# EAGLE design wiegand (EAGLE 6.6.0)
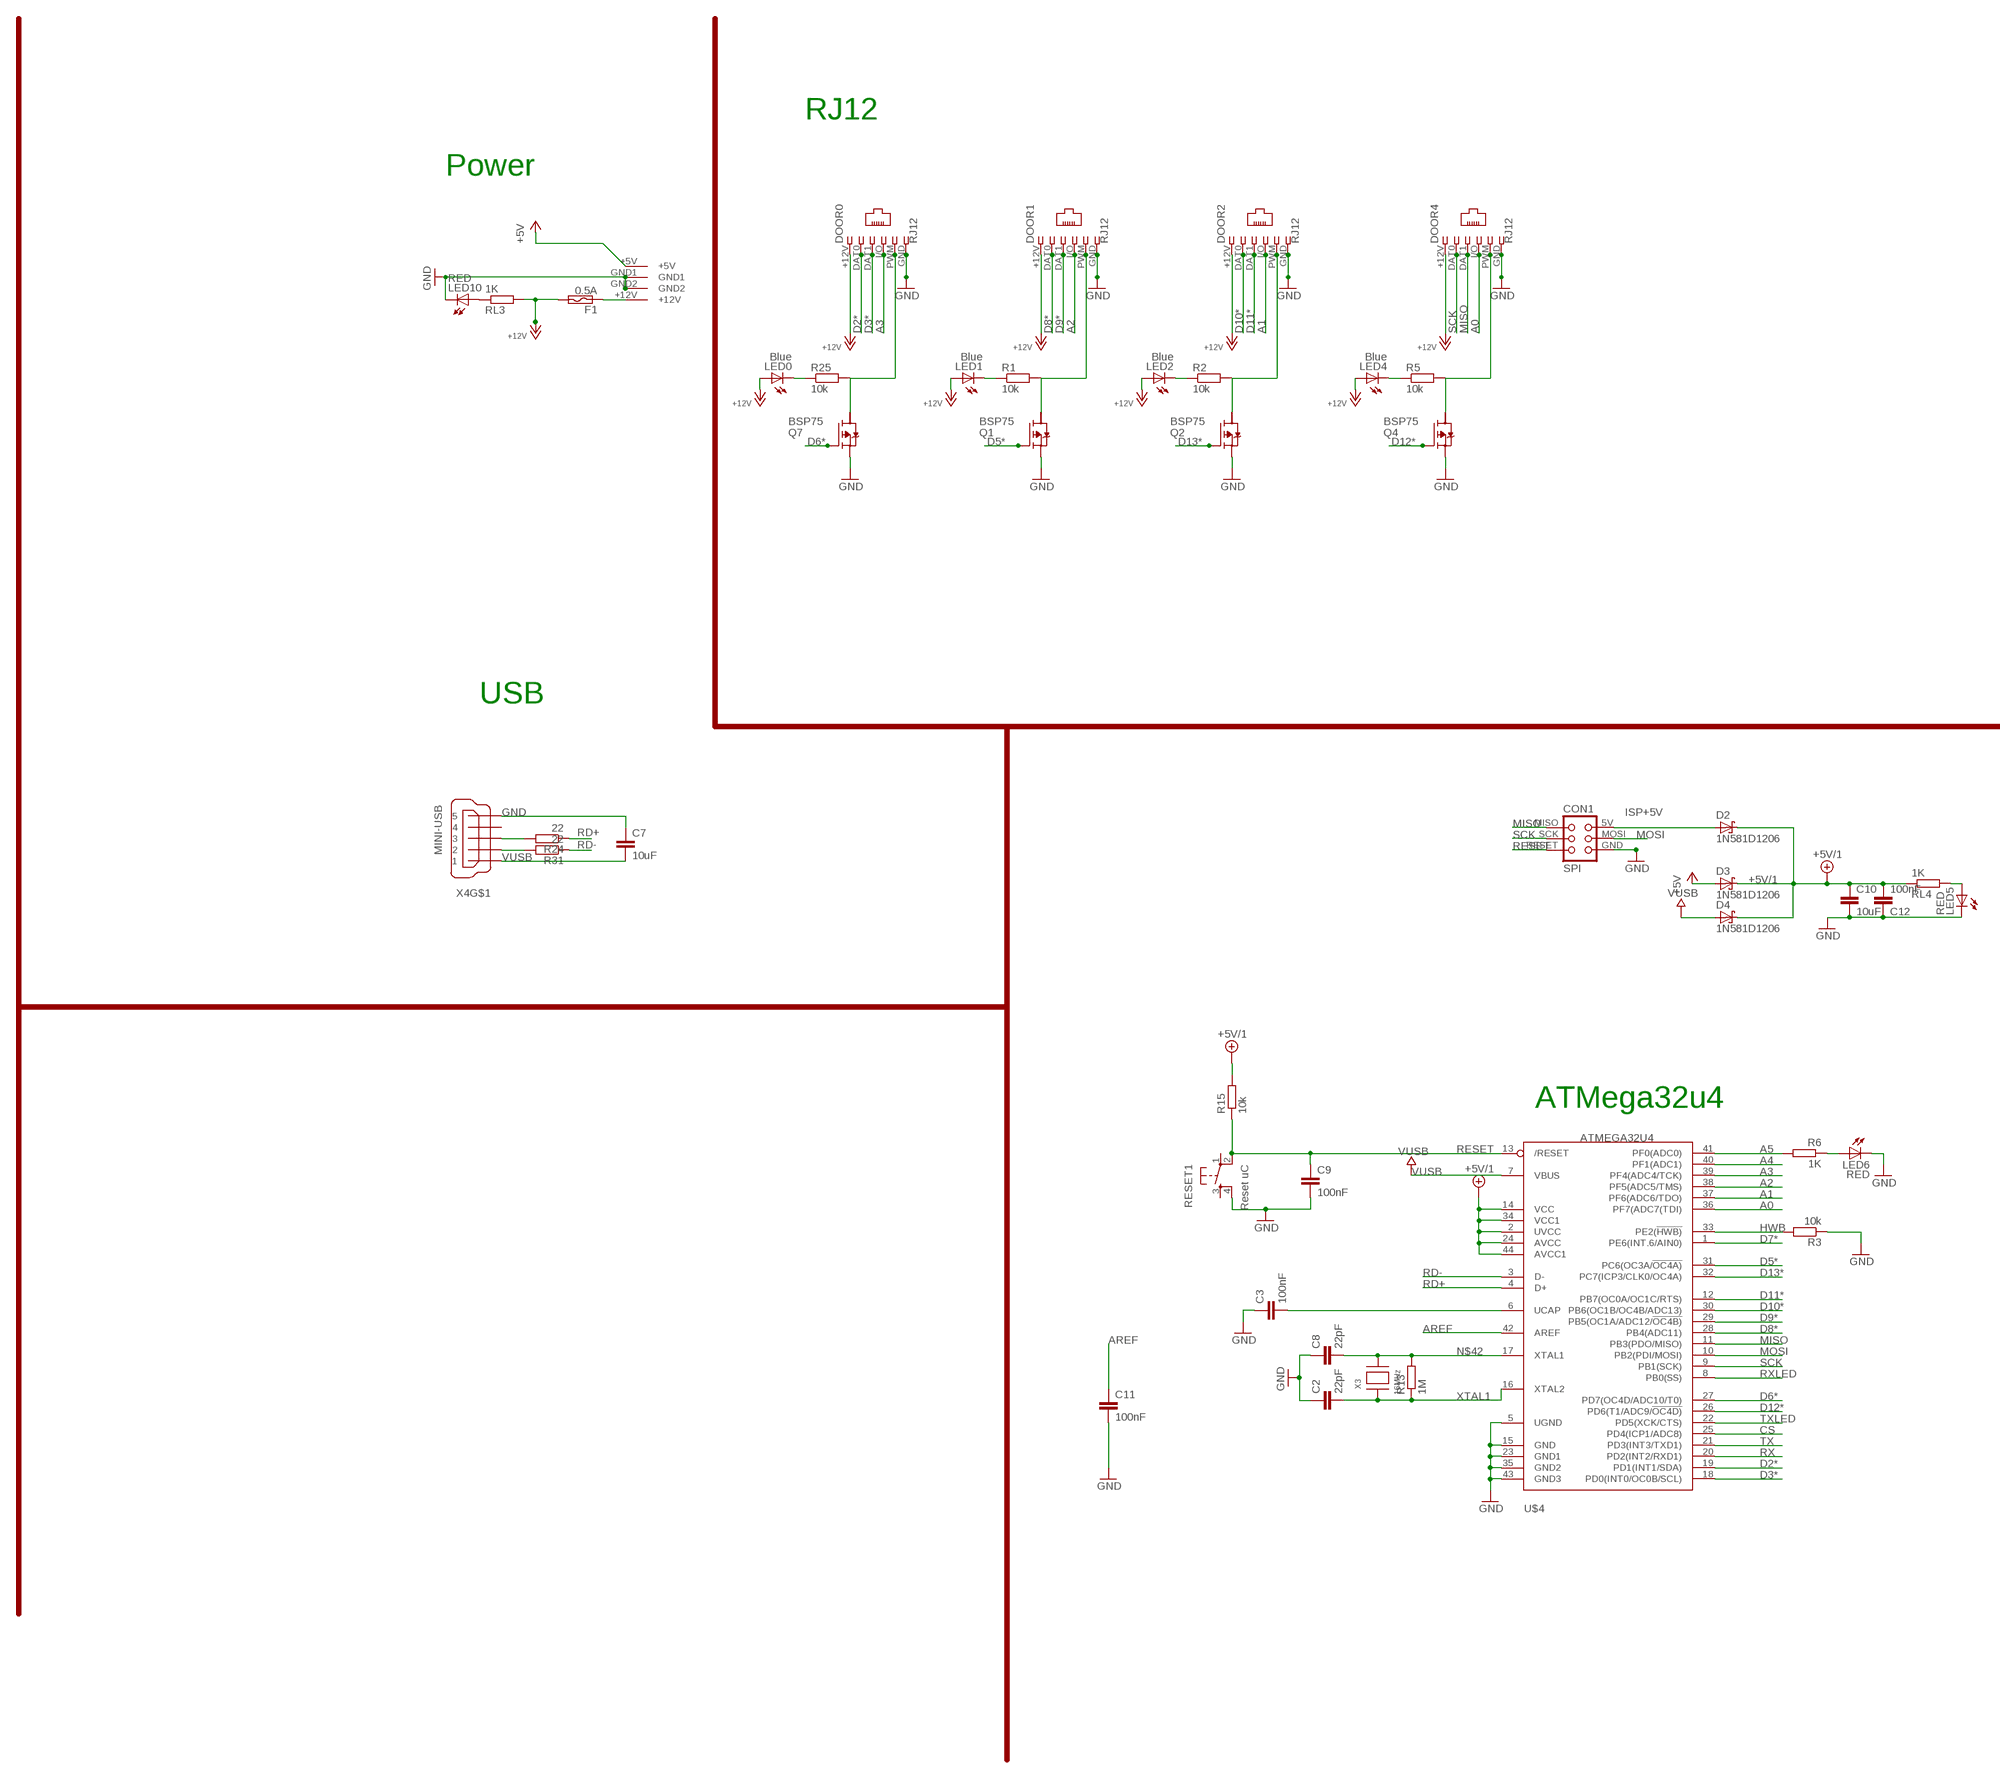
[diagram p0: schematic, sheet 1, part 1 of 2]
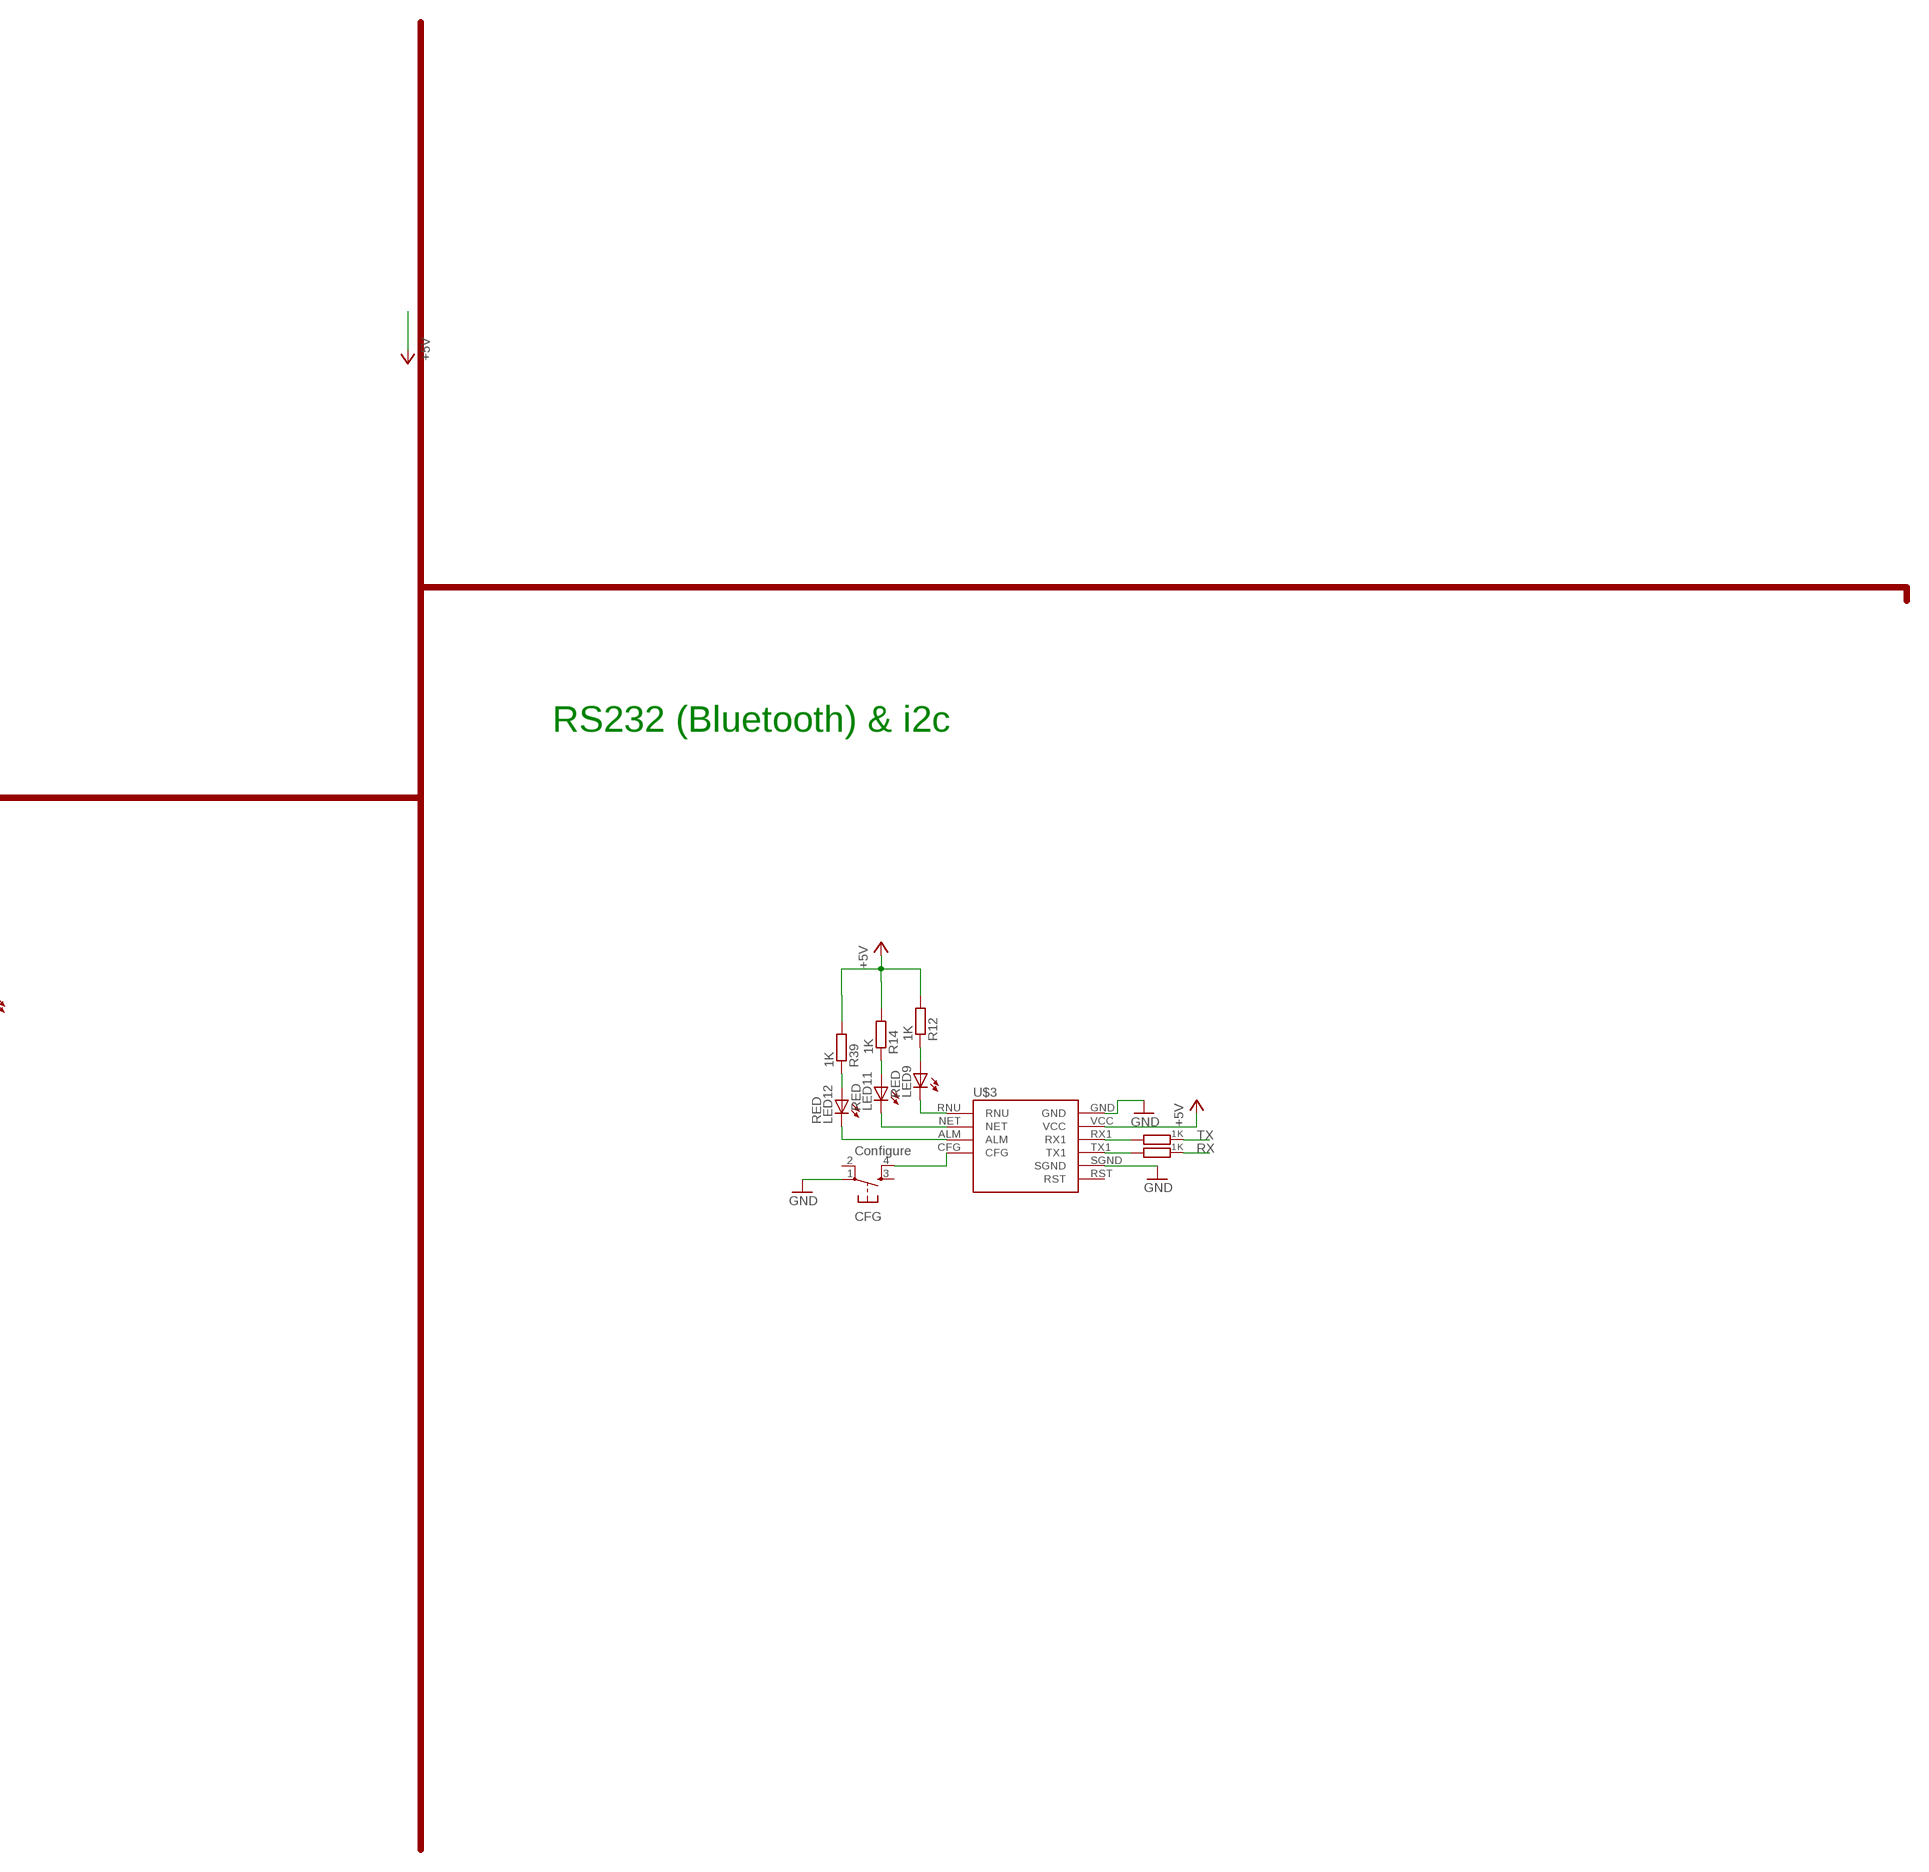
[diagram p1: schematic, sheet 1, part 2 of 2]

## Parts
C2  22pF  C-EUC1206  [C1206]
C3  100nF  C-EUC1206  [C1206]
C7  10uF  C-EUC1206  [C1206]
C8  22pF  C-EUC1206  [C1206]
C9  100nF  C-EUC1206  [C1206]
C10  10uF  C-EUC1206  [C1206]
C11  100nF  C-EUC1206  [C1206]
C12  100nF  C-EUC1206  [C1206]
CFG  Configure  TAC_SWITCHSMD  [TACTILE_SWITCH_SMD]
CON1  SPI  TINYISPTAG  [TC2030-MCP]
D2  1N581D1206  [LED-1206]
D3  1N581D1206  [LED-1206]
D4  1N581D1206  [LED-1206]
DOOR0  RJ12  RJ12STR-WIEGAND  [RJ12-STRAIGHT-WIEGAND]
DOOR1  RJ12  RJ12STR-WIEGAND  [RJ12-STRAIGHT-WIEGAND]
DOOR2  RJ12  RJ12STR-WIEGAND  [RJ12-STRAIGHT-WIEGAND]
DOOR4  RJ12  RJ12STR-WIEGAND  [RJ12-STRAIGHT-WIEGAND]
F1  0.5A  POLYSWITCHSMD1812  [C1812]
LED0  Blue  LED1206  [LED-1206]
LED1  Blue  LED1206  [LED-1206]
LED2  Blue  LED1206  [LED-1206]
LED4  Blue  LED1206  [LED-1206]
LED5  RED  LED1206  [LED-1206]
LED6  RED  LED1206  [LED-1206]
LED9  RED  LED1206  [LED-1206]
LED10  RED  LED1206  [LED-1206]
LED11  RED  LED1206  [LED-1206]
LED12  RED  LED1206  [LED-1206]
Q1  BSP75  BSP613P  [PG-SOT-223]
Q2  BSP75  BSP613P  [PG-SOT-223]
Q4  BSP75  BSP613P  [PG-SOT-223]
Q7  BSP75  BSP613P  [PG-SOT-223]
R1  10k  R-EU_R0805  [R0805]
R2  10k  R-EU_R0805  [R0805]
R3  10k  R-EU_M0805  [M0805]
R5  10k  R-EU_R0805  [R0805]
R6  1K  R-EU_R0805  [R0805]
R8  1K  R-EU_R0805  [R0805]
R11  1K  R-EU_R0805  [R0805]
R12  1K  R-EU_R0805  [R0805]
R13  1M  R-EU_R1206  [R1206]
R14  1K  R-EU_R0805  [R0805]
R15  10k  R-EU_M0805  [M0805]
R24  22  R-EU_M1206  [M1206]
R25  10k  R-EU_R0805  [R0805]
R31  22  R-EU_M1206  [M1206]
R39  1K  R-EU_R0805  [R0805]
RESET1  Reset uC  TAC_SWITCHSMD  [TACTILE_SWITCH_SMD]
RL3  1K  R-EU_R0805  [R0805]
RL4  1K  R-EU_R0805  [R0805]
U$3  SZ05-ZIGBEE  [SZ05-ZIGBEE]
U$4  ATMEGA32U4  ATMEGA32U4-AU  [TQFP44]
U$6  KPJX-4S-S  [KPJX-4S-S]
X3  16MHz  XTALNX6035  [NX6035]
X4  MINI-USB  MINI-USB-SCHIELD-32005-201  [32005-201]

## Nets
+5V [power]: D3.A R12.2 R14.2 R39.2 U$3.VCC U$6.+5V
+5V1 [power]: R6.2
+5V/1 [fine]: C10.1 C12.2 D2.C D3.C D4.C R15.2 RL4.1 U$4.2(UVCC) U$4.14(VCC) U$4.24(AVCC) U$4.34(VCC1) U$4.44(AVCC1)
+12V [power]: DOOR0.+12V DOOR1.+12V DOOR2.+12V DOOR4.+12V F1.2 LED0.A LED1.A LED2.A LED4.A RL3.2
A0: DOOR4.I/O U$4.36(PF7(ADC7(TDI))
A1: DOOR2.I/O U$4.37(PF6(ADC6/TDO))
A2: DOOR1.I/O U$4.38(PF5(ADC5/TMS))
A3: DOOR0.I/O U$4.39(PF4(ADC4/TCK))
A4: U$4.40(PF1(ADC1))
A5: U$4.41(PF0(ADC0))
AREF: C11.1 U$4.42(AREF)
CS: U$4.25(PD4(ICP1/ADC8))
D2*: DOOR0.DAT0 U$4.19(PD1(INT1/SDA))
D3*: DOOR0.DAT1 U$4.18(PD0(INT0/OC0B/SCL))
D5*: Q1.1(G) U$4.31(PC6(OC3A/!OC4A))
D6*: Q7.1(G) U$4.27(PD7(OC4D/ADC10/T0))
D7*: U$4.1(PE6(INT.6/AIN0))
D8*: DOOR1.DAT0 U$4.28(PB4(ADC11))
D9*: DOOR1.DAT1 U$4.29(PB5(OC1A/ADC12/!OC4B))
D10*: DOOR2.DAT0 U$4.30(PB6(OC1B/OC4B/ADC13))
D11*: DOOR2.DAT1 U$4.12(PB7(OC0A/OC1C/RTS))
D12*: Q4.1(G) U$4.26(PD6(T1/ADC9/!OC4D))
D13*: Q2.1(G) U$4.32(PC7(ICP3/CLK0/OC4A))
D+USB: R24.2 X4.3
D-USB: R31.2 X4.2
GND [power]: C2.1 C3.1 C7.1 C8.1 C9.2 C10.2 C11.2 C12.1 CFG.1 CON1.GND DOOR0.GND DOOR1.GND DOOR2.GND DOOR4.GND LED5.C LED6.C LED10.C Q1.3(S) Q2.3(S) Q4.3(S) Q7.3(S) R3.1 RESET1.4 U$3.GND U$3.SGND U$4.5(UGND) U$4.15(GND) U$4.23(GND1) U$4.35(GND2) U$4.43(GND3) U$6.GND1 U$6.GND2 X4.5
GND1 [VIN]: LED9.C U$3.RNU
GND2 [VIN]: LED11.C U$3.NET
GND3 [VIN]: LED12.C U$3.ALM
HWB: R3.2 U$4.33(PE2(!HWB))
ISP+5V: CON1.5V(VCC) D2.A
MISO: CON1.MISO DOOR4.DAT1 U$4.11(PB3(PDO/MISO))
MOSI: CON1.MOSI U$4.10(PB2(PDI/MOSI))
N$1: LED0.C R25.1
N$2: LED6.A R6.1
N$3 [power]: DOOR1.PWM Q1.2(D) R1.2
N$5: LED1.C R1.1
N$6: LED2.C R2.1
N$7 [power]: DOOR2.PWM Q2.2(D) R2.2
N$9: LED4.C R5.1
N$11: R11.2 U$3.RX1
N$12: LED5.A RL4.2
N$16: C3.2 U$4.6(UCAP)
N$23 [power]: DOOR0.PWM Q7.2(D) R25.2
N$24: R8.2 U$3.TX1
N$25: LED9.A R12.1
N$26: LED11.A R14.1
N$27: LED12.A R39.1
N$31 [power]: DOOR4.PWM Q4.2(D) R5.2
N$35: CFG.4 U$3.CFG
N$39: F1.1 U$6.+12V
N$42: C8.2 R13.2 U$4.17(XTAL1) X3.P$2
N$75: LED10.A RL3.1
RD+: R24.1 U$4.4(D+)
RD-: R31.1 U$4.3(D-)
RESET: C9.1 CON1.RESET R15.1 RESET1.2 U$4.13(/RESET)
RX: R8.1 U$4.20(PD2(INT2/RXD1))
RXLED: U$4.8(PB0(SS))
SCK: CON1.SCK DOOR4.DAT0 U$4.9(PB1(SCK))
TX: R11.1 U$4.21(PD3(INT3/TXD1))
TXLED: U$4.22(PD5(XCK/CTS))
VUSB: C7.2 D4.A U$4.7(VBUS) X4.1
XTAL1: C2.2 R13.1 U$4.16(XTAL2) X3.P$1
Unconnected: CFG.2 CFG.3 Q1.4(D) Q2.4(D) Q4.4(D) Q7.4(D) RESET1.1 RESET1.3 U$3.RST X4.4 X4.M1(S:S1) X4.M2(S:S2) X4.M3(S:S3) X4.M4(S:S4)

## Notes on the sheet
- RJ12
- Power
- RS232 (Bluetooth) & i2c
- USB
- ATMega32u4

## Library data of the parts
C2 C3 C7-C12 = rcl:C-EU: CAPACITOR, European symbol
CFG RESET1 = lpatiny:TAC_SWITCH: Momentary Switch Button commonly used for reset or general input. Spark Fun Electronics SKU : COM-00097
CON1 = lpatiny:TINYISP: CONNECTOR
D2-D4 = lpatiny:1N581*: 1.0A SCHOTTKY BARRIER RECTIFIER Source: http://www.diodes.com/datasheets/ds23001.pdf
DOOR0 DOOR1 DOOR2 DOOR4 = lpatiny:RJ12: CORCOM Modular RJ Jacks No Shield Source: www.tycoelectronics.com .. ENG_DS_1654001_1099_RJ_L_0507.pdf
F1 = lpatiny:POLYSWITCH: PolySwitch (TM) Resettable Device Source: Data sheet <http://www.farnell.com/datasheets/13482.pdf>
LED0 LED1 LED2 LED4-LED6 LED9-LED12 = SparkFun:LED: LEDs Standard schematic elements and footprints for 5mm, 3mm, 1206, and 0603 sized LEDs. 5mm - Spark Fun Electronics SKU : COM-00529 (and others)
Q1 Q2 Q4 Q7 = infineon:BSP613P: SIPMOS (R) Small-Signal-Transistor P-Channel (2 Drain) Source: http://www.infineon.com/dgdl/BSP613P_Rev2.4.pdf; OC_FARNELL: unknown; OC_NEWARK: unknown
R1 R2 R5 R6 R8 R11-R14 R25 R39 RL3 = rcl:R-EU_: RESISTOR, European symbol
R3 R15 R24 R31 RL4 = resistor:R-EU_: RESISTOR, European symbol
U$3 = lpatiny:SZ05-ZIGBEE
U$4 = adafruit:ATMEGA32U4: http://www.ladyada.net/library/eagle
U$6 = lpatiny:KPJX-4S-S
X3 = lpatiny:XTAL: Low cost SMT crystals, no capacitors included http://www.ladyada.net/library/eagle
X4 = con-cypressindustries:MINI-USB-SCHIELD-: MINI USB-B Conector Source: www.cypressindustries.com; OC_FARNELL: unknown; OC_NEWARK: unknown

## Net classes
0 default: width 0.457 mm
1 power: width 0.61 mm
2 VIN: width 0.457 mm
3 fine: width 0.457 mm
4 aref: width 0.457 mm

## Board
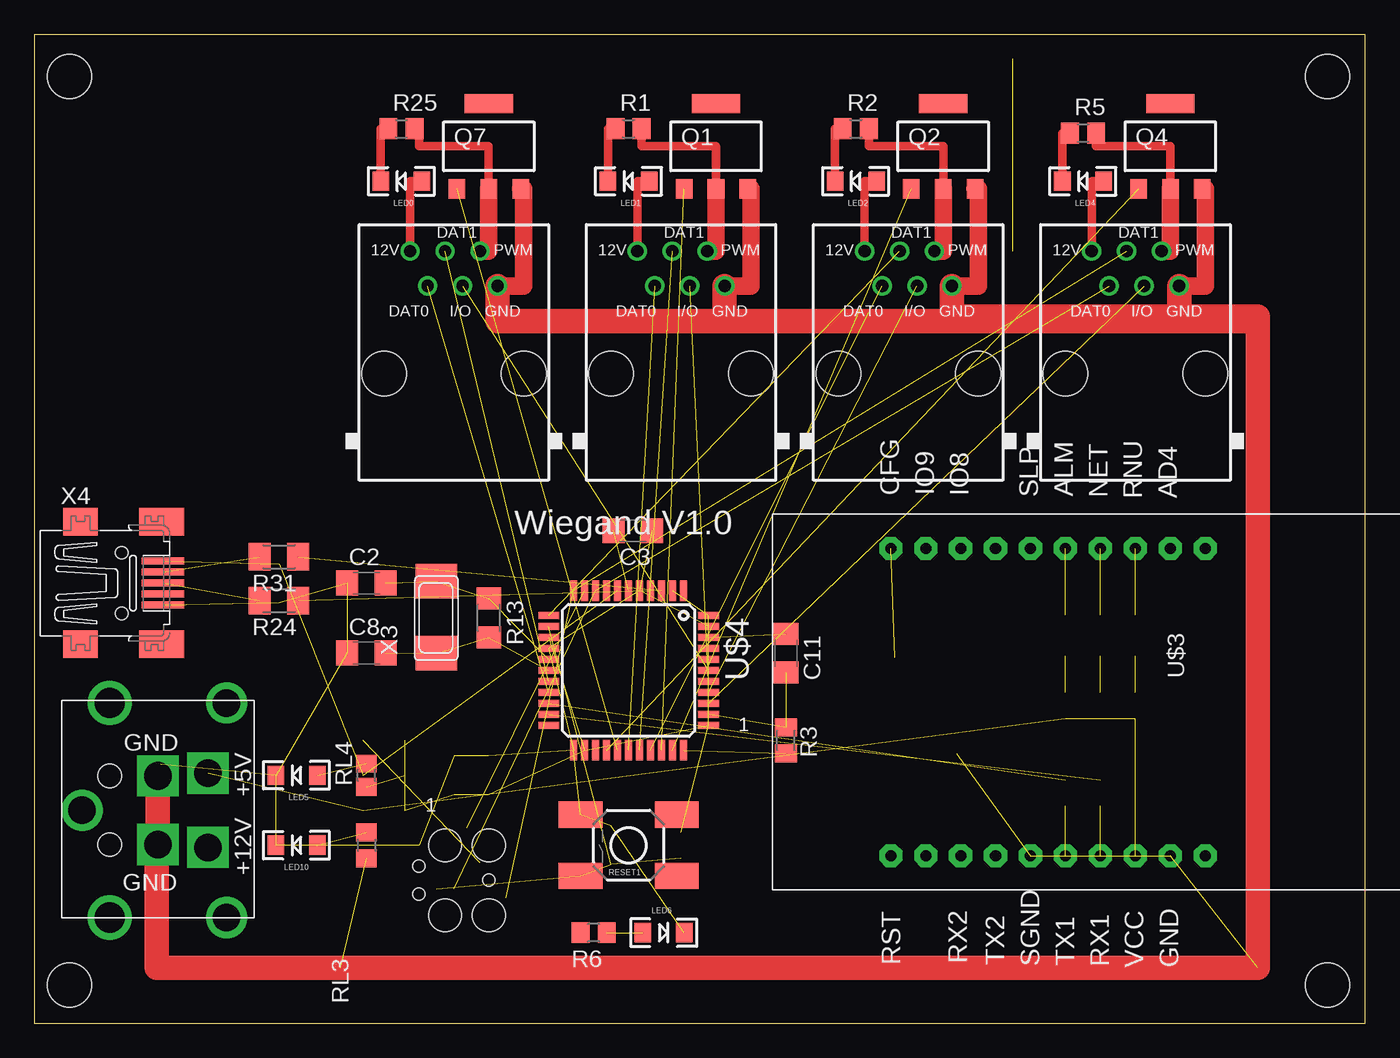
[diagram p2: board, top side]
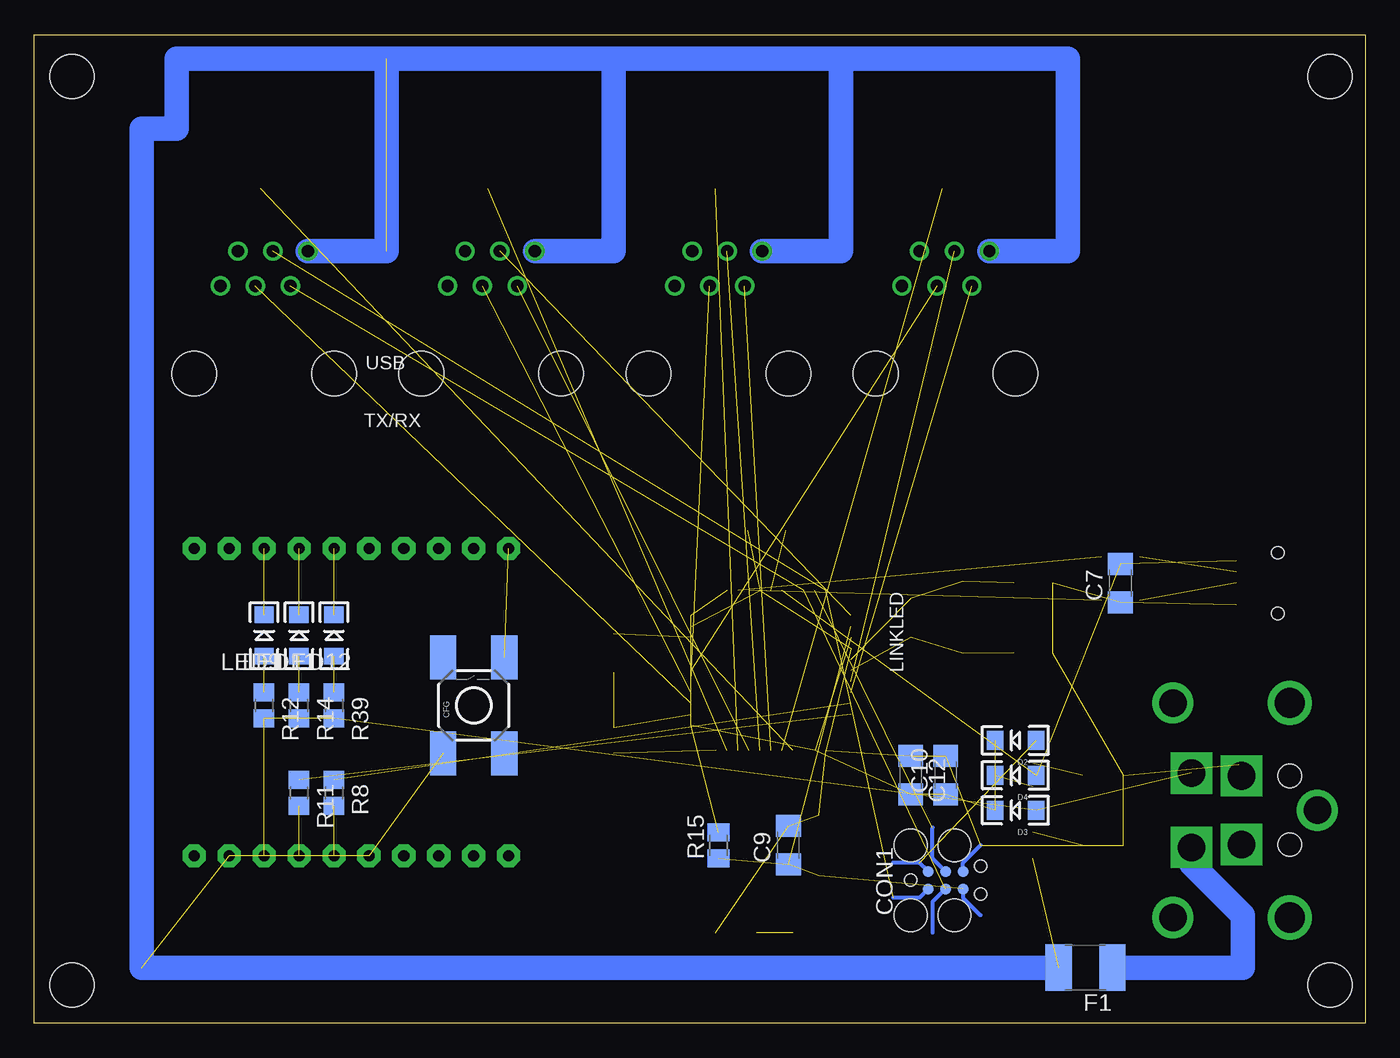
[diagram p3: board, bottom side, seen from below]

Size 96.7 x 71.87 mm. Coordinates in mm from the lower left corner, seen from the top.
Outline: 0,0 96.7,0 96.7,71.87 0,71.87 0,0
Copper layers (1*16): Top 0.035mm / dielectric 1.5mm / Bottom 0.035mm
Design rules "Fusion_eagle_rule_v1.1": minimum track width 6mil, minimum drill 12mil, track to track 6mil, track to pad 6mil, pad to pad 6mil, via to via 6mil, smd to smd 0mil, copper to edge 10mil, drill to drill 10mil, minimum pad ring 10mil, minimum via ring 6mil, stop-mask expansion 2mil, vias tented up to drill 100mil, thermal gap 10mil
Holes 3.2 mm at 2.54,2.79 2.54,68.83 93.98,68.83 93.98,2.79
bKeepout: area -1.3,54.9 to 114.3,82.8; area -7.6,52.3 to 108,80.3
vRestrict: area 47,23.1 to 62.2,26.9; area 34.3,16.8 to 52.1,23.1; area 34.3,28.2 to 52.1,34.5; area 45.7,16.8 to 52.1,34.5; area 34.3,16.8 to 40.6,34.5

### Footprints (pad centres in the part's own frame; a part is rotated, then mirrored left to right if it is on the bottom)
C1206 = smd 1.6 x 1.8: 1 -1.4,0; 2 1.4,0
TACTILE_SWITCH_SMD = smd 3.175 x 1.905: 1 -3.493,2.223; 2 3.493,2.223; 3 -3.493,-2.223; 4 3.493,-2.223
TC2030-MCP = smd 0.787 x 0.787: 5V 1.27,0.635; GND 3.81,0.635; MISO 1.27,-0.635; MOSI 2.54,0.635; RESET 3.81,-0.635; SCK 2.54,-0.635 | hole 0.889: 0,0; 5.08,-1.016; 5.08,1.016 | hole 2.375: 0,2.54; 0,-2.54; 3.175,-2.54; 3.175,2.54
LED-1206 = smd 1.2 x 1.4: A -1.5,0; C 1.5,0
RJ12-STRAIGHT-WIEGAND = drill 0.9 pad 1.4: +12V -3.175,7.62; DAT0 -1.905,5.08; DAT1 -0.635,7.62; GND 3.175,5.08; I/O 0.635,5.08; PWM 1.905,7.62 | hole 3.251: -5.08,-1.27; 5.08,-1.27
C1812 = smd 1.9 x 3.4: 1 -1.95,0; 2 1.95,0
PG-SOT-223 = smd 1.2 x 1.4: 1 -2.311,-3.099; 2 0,-3.099; 3 2.311,-3.099 | smd 3.5 x 1.4: 4 0,3.099
R0805 = smd 1.3 x 1.5: 1 -0.95,0; 2 0.95,0
M0805 = smd 1.3 x 1.6: 1 -0.95,0; 2 0.95,0
R1206 = smd 1.6 x 1.803: 1 -1.422,0; 2 1.422,0
M1206 = smd 1.6 x 2: 1 -1.4,0; 2 1.4,0
R0805' = smd 1.3 x 1.5: 1 -0.85,0; 2 0.85,0
SZ05-ZIGBEE = drill 0.8 pad 1.676 octagon: 6 -11.415,13.971; 7 -11.415,11.431; 11 -11.415,1.271; 12 -11.415,-1.269; 13 -11.415,-3.809; 14 -11.415,-6.349; 17 10.925,-6.349; 18 10.925,-3.809; 19 10.925,-1.269; 25 10.925,13.971; ALM -11.415,3.811; CFG -11.415,-8.889; GND 10.925,11.431; NET -11.415,6.351; RNU -11.415,8.891; RST 10.925,-8.889; RX1 10.925,6.351; SGND 10.925,1.271; TX1 10.925,3.811; VCC 10.925,8.891
TQFP44 = smd 1.5 x 0.5: 1 -5.8,4; 2 -5.8,3.2; 3 -5.8,2.4; 4 -5.8,1.6; 5 -5.8,0.8; 6 -5.8,0; 7 -5.8,-0.8; 8 -5.8,-1.6; 9 -5.8,-2.4; 10 -5.8,-3.2; 11 -5.8,-4; 23 5.8,-4; 24 5.8,-3.2; 25 5.8,-2.4; 26 5.8,-1.6; 27 5.8,-0.8; 28 5.8,0; 29 5.8,0.8; 30 5.8,1.6; 31 5.8,2.4; 32 5.8,3.2; 33 5.8,4 | smd 0.5 x 1.5: 12 -4,-5.8; 13 -3.2,-5.8; 14 -2.4,-5.8; 15 -1.6,-5.8; 16 -0.8,-5.8; 17 0,-5.8; 18 0.8,-5.8; 19 1.6,-5.8; 20 2.4,-5.8; 21 3.2,-5.8; 22 4,-5.8; 34 4,5.8; 35 3.2,5.8; 36 2.4,5.8; 37 1.6,5.8; 38 0.8,5.8; 39 0,5.8; 40 -0.8,5.8; 41 -1.6,5.8; 42 -2.4,5.8; 43 -3.2,5.8; 44 -4,5.8
KPJX-4S-S = drill 2 square: +5V 2.7,1.35; +12V -2.7,1.35; GND1 -2.5,5; GND2 2.5,5 | drill 2: P$1 -7.8,0; P$2 7.8,0; P$11 0,10.5 | drill 2.2: P$3 -7.8,8.5; P$4 7.8,8.5 | hole 1.7: -2.5,8.5; 2.5,8.5
NX6035 = smd 2.5 x 3: P$1 2.665,0; P$2 -2.565,0
32005-201 = smd 3.1 x 0.5: 1 3,1.6; 2 3,0.8; 3 3,0; 4 3,-0.8; 5 3,-1.6 | smd 2.5 x 2: M1 -3,-4.45; M2 -3,4.45 | smd 3.3 x 2: M3 2.9,4.45; M4 2.9,-4.45 | hole 0.9: 0,2.2; 0,-2.2

### Placement (x,y rotation side)
C2  24.13,32 0 top
C3  43.5,35.81 180 top
C7  17.78,32 90 bottom
C8  24.13,26.92 0 top
C9  41.91,12.95 90 bottom
C10  30.48,18.03 90 bottom
C11  54.61,26.92 270 top
C12  33.02,18.03 270 bottom
CFG  64.77,23.11 90 bottom
CON1  33.02,10.41 0 bottom
D2  25.4,20.57 180 bottom
D3  25.4,15.49 180 bottom
D4  25.4,18.03 180 bottom
DOOR0  30.48,48.51 0 top
DOOR1  46.99,48.51 0 top
DOOR2  63.5,48.51 0 top
DOOR4  80.01,48.51 0 top
F1  20.32,4.06 180 bottom
LED0  26.67,61.21 180 top
LED1  43.18,61.21 180 top
LED2  59.69,61.21 180 top
LED4  76.2,61.21 180 top
LED5  19.05,18.03 180 top
LED6  45.72,6.6 0 top
LED9  80.01,28.19 90 bottom
LED10  19.05,12.95 180 top
LED11  77.47,28.19 90 bottom
LED12  74.93,28.19 90 bottom
Q1  49.53,63.75 0 top
Q2  66.04,63.75 0 top
Q4  82.55,63.75 0 top
Q7  33.02,63.75 0 top
R1  43.18,65.02 0 top
R2  59.69,65.02 0 top
R3  54.61,20.57 270 top
R5  76.2,64.71 0 top
R6  40.64,6.6 180 top
R8  74.93,16.76 270 bottom
R11  77.47,16.76 270 bottom
R12  80.01,23.11 270 bottom
R13  33.02,29.46 270 top
R14  77.47,23.11 270 bottom
R15  46.99,12.95 90 bottom
R24  17.78,30.73 180 top
R25  26.67,65.02 0 top
R31  17.78,33.91 180 top
R39  74.93,23.11 270 bottom
RESET1  43.18,12.95 180 top
RL3  24.13,12.95 270 top
RL4  1K  [R0805']  24.13,18.03 90 top
U$3  71.12,23.11 270 top
U$4  43.18,25.65 270 top
U$6  13.97,15.49 90 top
X3  29.21,29.46 90 top
X4  6.35,32 0 top

### Tracks (layer width: path | path; a pad name or v marks a point on that pad's centre or on a via)
+5V  (5 unrouted)
+5V/1  (11 unrouted)
+12V  (3 unrouted)
  Top 0.61: LED0.A 27.3,61.21 DOOR0.+12V | LED1.A 43.81,61.21 DOOR1.+12V | LED2.A 60.33,61.21 DOOR2.+12V | LED4.A 76.83,61.21 DOOR4.+12V
  Bottom 1.778: F1.2 88.9,4.06 88.9,65.02 86.36,65.02 86.36,70.1 71.12,70.1 | 71.12,70.1 54.61,70.1 | 54.61,70.1 38.1,70.1 | 38.1,70.1 21.59,70.1 21.59,56.13 DOOR0.+12V | DOOR1.+12V 38.1,56.13 38.1,70.1 | DOOR2.+12V 54.61,56.13 54.61,70.1 | DOOR4.+12V 71.12,56.13 71.12,70.1
A0  (1 unrouted)
A1  (1 unrouted)
A2  (1 unrouted)
A3  (1 unrouted)
AREF  (1 unrouted)
D2*  (1 unrouted)
D3*  (1 unrouted)
D5*  (1 unrouted)
D6*  (1 unrouted)
D8*  (1 unrouted)
D9*  (1 unrouted)
D10*  (1 unrouted)
D11*  (1 unrouted)
D12*  (1 unrouted)
D13*  (1 unrouted)
D+USB  (1 unrouted)
D-USB  (1 unrouted)
GND  (23 unrouted)
  Top 0.457: 9.2,18.85 U$6.GND2
  Top 1.27: Q7.3 35.56,60.66 35.56,53.59 DOOR0.GND | Q1.3 52.07,60.66 52.07,53.59 DOOR1.GND | Q2.3 68.58,60.66 68.58,53.59 DOOR2.GND | Q4.3 85.09,60.66 85.09,53.59 DOOR4.GND
  Top 1.778: 83.19,51.05 66.67,51.05 | 66.67,51.05 50.16,51.05 | 50.16,51.05 33.66,51.05 DOOR0.GND | U$6.GND2 U$6.GND1 8.89,12.91 8.89,4.06 88.9,4.06 88.9,51.05 | DOOR1.GND 50.16,51.05 | 66.67,51.37 66.67,51.05 | DOOR4.GND 83.19,51.05 | 88.9,51.05 83.19,51.05 | DOOR2.GND 66.67,51.37 | 66.67,51.37 88.9,51.37 88.9,51.05
  Bottom 0.305: CON1.GND 29.21,11.68 27.94,12.95
GND1  (1 unrouted)
GND2  (1 unrouted)
GND3  (1 unrouted)
HWB  (1 unrouted)
ISP+5V  (1 unrouted)
  Bottom 0.305: CON1.5V 32.38,11.68 34.29,11.68
MISO  (2 unrouted)
  Bottom 0.305: CON1.MISO 32.38,9.14 34.29,9.14
MOSI  (1 unrouted)
  Bottom 0.305: CON1.MOSI 31.43,12 31.43,14.22
N$1
  Top 0.61: R25.1 25.17,65.02 LED0.C
N$2  (1 unrouted)
N$3
  Top 0.61: Q1.2 49.53,63.75 44.13,63.75 R1.2
  Top 1.27: Q1.2 49.53,56.13 DOOR1.PWM
N$5
  Top 0.61: R1.1 41.68,65.02 LED1.C
N$6
  Top 0.61: R2.1 58.19,65.02 LED2.C
N$7
  Top 0.61: Q2.2 66.04,63.75 60.64,63.75 R2.2
  Top 1.27: Q2.2 66.04,56.13 DOOR2.PWM
N$9
  Top 0.61: R5.1 74.7,64.71 LED4.C
N$11  (1 unrouted)
N$12  (1 unrouted)
N$16  (1 unrouted)
N$23
  Top 0.61: Q7.2 33.02,63.75 27.94,63.75 27.94,65.02 R25.2
  Top 1.27: Q7.2 33.02,56.13 DOOR0.PWM
N$24  (1 unrouted)
N$25  (1 unrouted)
N$26  (1 unrouted)
N$27  (1 unrouted)
N$31
  Top 0.61: Q4.2 82.55,63.75 77.15,63.75 R5.2
  Top 1.27: Q4.2 82.55,56.13 DOOR4.PWM
N$35  (1 unrouted)
N$39
  Bottom 1.778: U$6.+12V 12.62,11.6 8.89,7.87 8.89,4.06 F1.1
N$42  (3 unrouted)
N$75  (1 unrouted)
RD+  (1 unrouted)
RD-  (1 unrouted)
RESET  (4 unrouted)
  Bottom 0.305: CON1.RESET 29.21,9.14 27.94,7.87
RX  (1 unrouted)
SCK  (2 unrouted)
  Bottom 0.305: CON1.SCK 31.43,8.83 31.43,6.6
TX  (1 unrouted)
VUSB  (3 unrouted)
XTAL1  (3 unrouted)

### Text on the board
tNames: Wiegand V1.0 | 1 | 1
bNames: USB | TX/RX | LINKLED
tValues: Wiegand v1.1
203bmp: C:/Users/G/Pictures/logo_epfl.bmp